# Altium schematic sheet 03_02_MCU_STM32F4_Interface.SchDoc
size A4; SheetNumber: 5; SheetTotal: 9
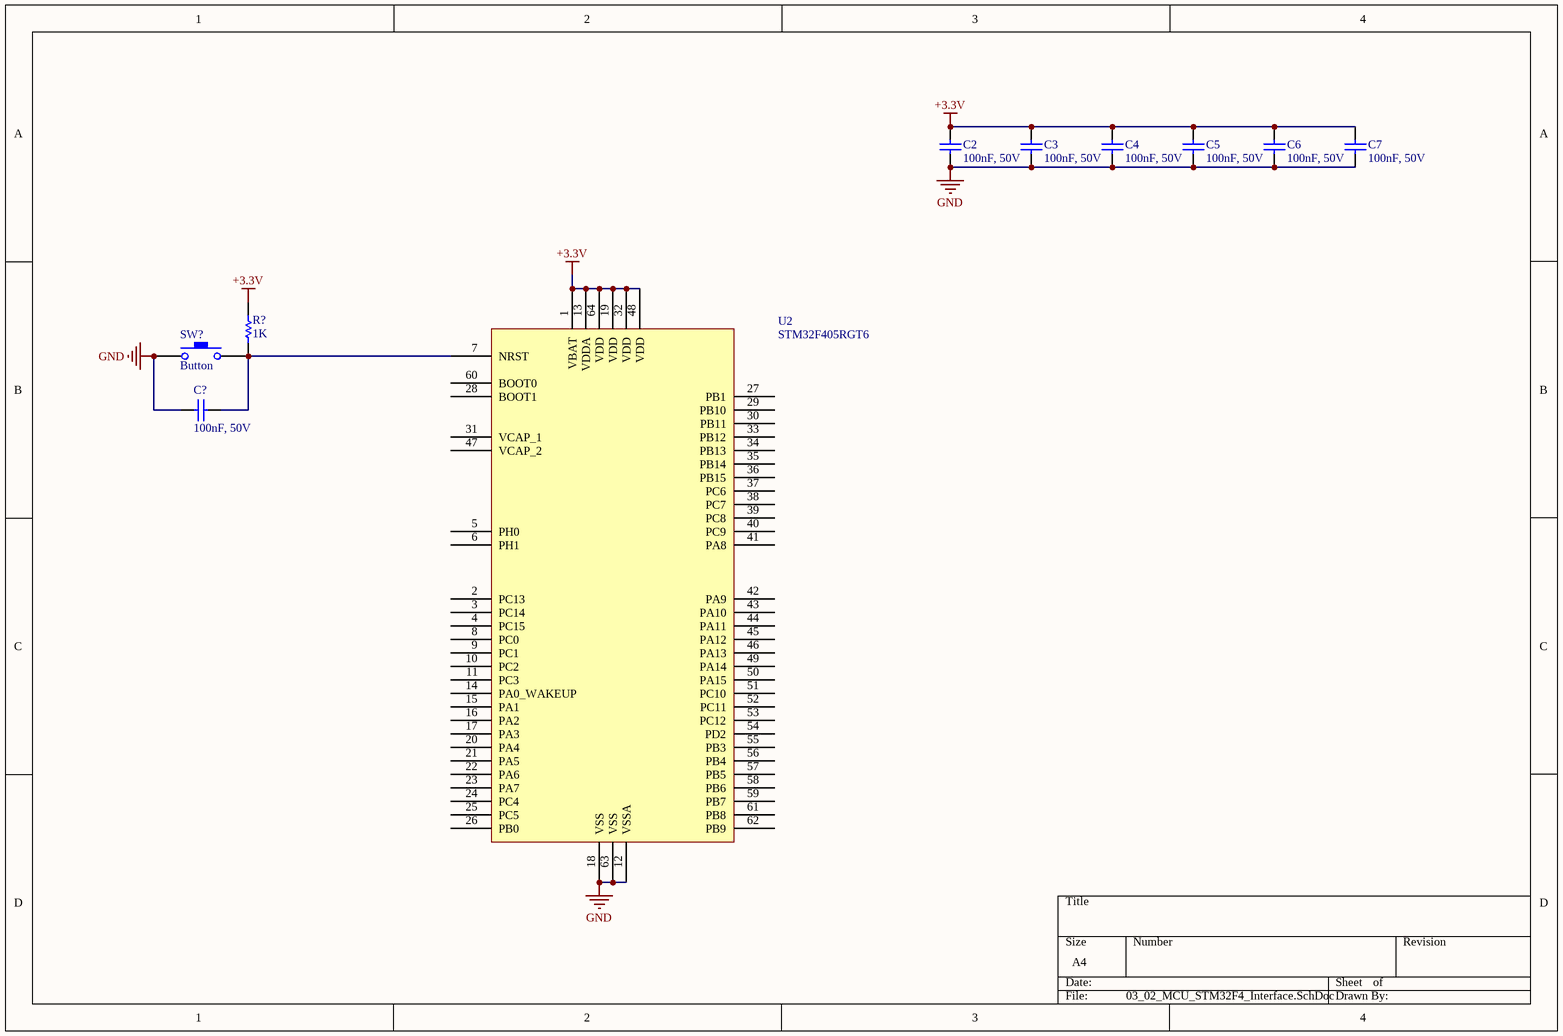
[diagram p0: 03_02_MCU_STM32F4_Interface.SchDoc]

## Parts
C2  100nF, 50V  [WCAP-CSGP_0603_H=0.8mm_Reflow]
C3  100nF, 50V  [WCAP-CSGP_0603_H=0.8mm_Reflow]
C4  100nF, 50V  [WCAP-CSGP_0603_H=0.8mm_Reflow]
C5  100nF, 50V  [WCAP-CSGP_0603_H=0.8mm_Reflow]
C6  100nF, 50V  [WCAP-CSGP_0603_H=0.8mm_Reflow]
C7  100nF, 50V  [WCAP-CSGP_0603_H=0.8mm_Reflow]
C?  100nF, 50V  [WCAP-CSGP_0603_H=0.8mm_Reflow]
R?  value 1K  [RES-SM-0603]  (hidden comment: RESISTOR SMD)
SW?  Button  [Button 4-pin SMD]
U2  STM32F405RGT6  [CQFP50P1150X1150X160-64N]

## Nets
+3.3V: C2.2 C3.2 C4.2 C5.2 C6.2 C7.2 R?.2 U2.1(VBAT) U2.13(VDDA) U2.19(VDD) U2.32(VDD) U2.48(VDD) U2.64(VDD)
GND: C2.1 C3.1 C4.1 C5.1 C6.1 C7.1 C?.1 SW?.1 U2.12(VSSA) U2.18(VSS) U2.63(VSS)
NetC?_2: C?.2 R?.1 SW?.2 U2.7(NRST)

Not connected (* = marked no-connect by the designer): U2 2(PC13) 3(PC14) 4(PC15) 5(PH0) 6(PH1) 8(PC0) 9(PC1) 10(PC2) 11(PC3) 14(PA0_WAKEUP) 15(PA1) 16(PA2) 17(PA3) 20(PA4) 21(PA5) 22(PA6) 23(PA7) 24(PC4) 25(PC5) 26(PB0) 27(PB1) 28(BOOT1) 29(PB10) 30(PB11) 31(VCAP_1) 33(PB12) 34(PB13) 35(PB14) 36(PB15) 37(PC6) 38(PC7) 39(PC8) 40(PC9) 41(PA8) 42(PA9) 43(PA10) 44(PA11) 45(PA12) 46(PA13) 47(VCAP_2) 49(PA14) 50(PA15) 51(PC10) 52(PC11) 53(PC12) 54(PD2) 55(PB3) 56(PB4) 57(PB5) 58(PB6) 59(PB7) 60(BOOT0) 61(PB8) 62(PB9)

## Library data of the parts
C2-C7 C? = 885012206095: WCAP-CSGP Multilayer Ceramic Chip Capacitor, General Purpose, size 0603, X7R, 100nF, 50V; Manufacturer: Wurth Elektronik; Rated Voltage: 50VDC; Isolation Resistance: >=5GOhm; Capacitance Tolerance: +/-10%; Technical Reference: X7R0603104K050DFCT10000; ComponentLink1Description: Manufacturer; ComponentLink1URL: http://www.we-online.de; ComponentLink2Description: Datasheet; ComponentLink2URL: https://www.we-online.com/catalog/datasheet/885012206095.pdf; Operating Temperature: -55 to +125degC; Packaging: Tape and Reel; Manufacturer Part Number: 885012206095; Published Date: May 2020; Ceramic Type: X7R; Dissipation Factor: =<3%; Height: 0.8mm; Mounting Technology: SMT; Size: 0603; Capacitance: 100nF
R? = RESISTOR SMD: Resistor
U2 = STM32F405RGT6: Manufacturer: ST; ComponentLink1Description: Supplier 1 Link